# EAGLE design servo&air (EAGLE 7.2.0)
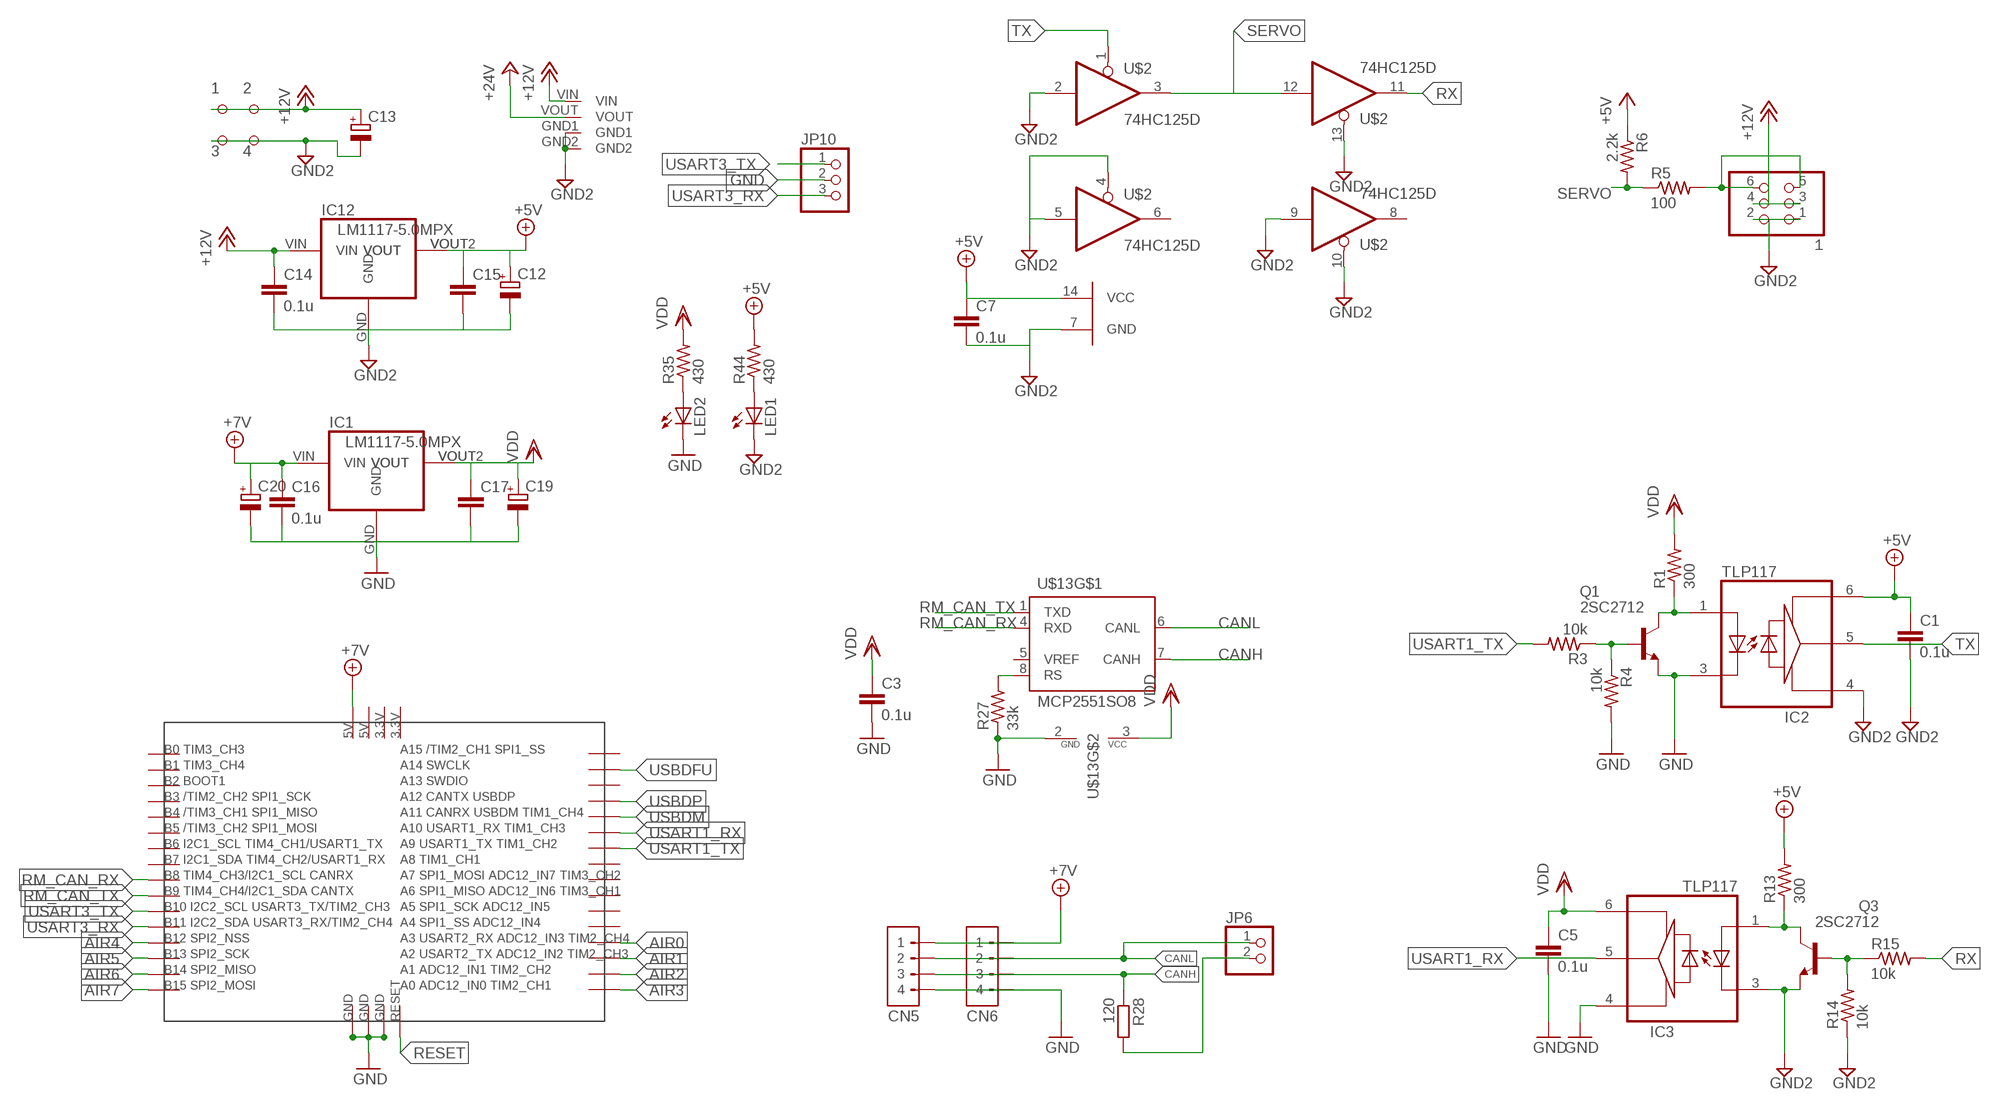
[diagram p0: schematic, sheet 1, part 1 of 2]
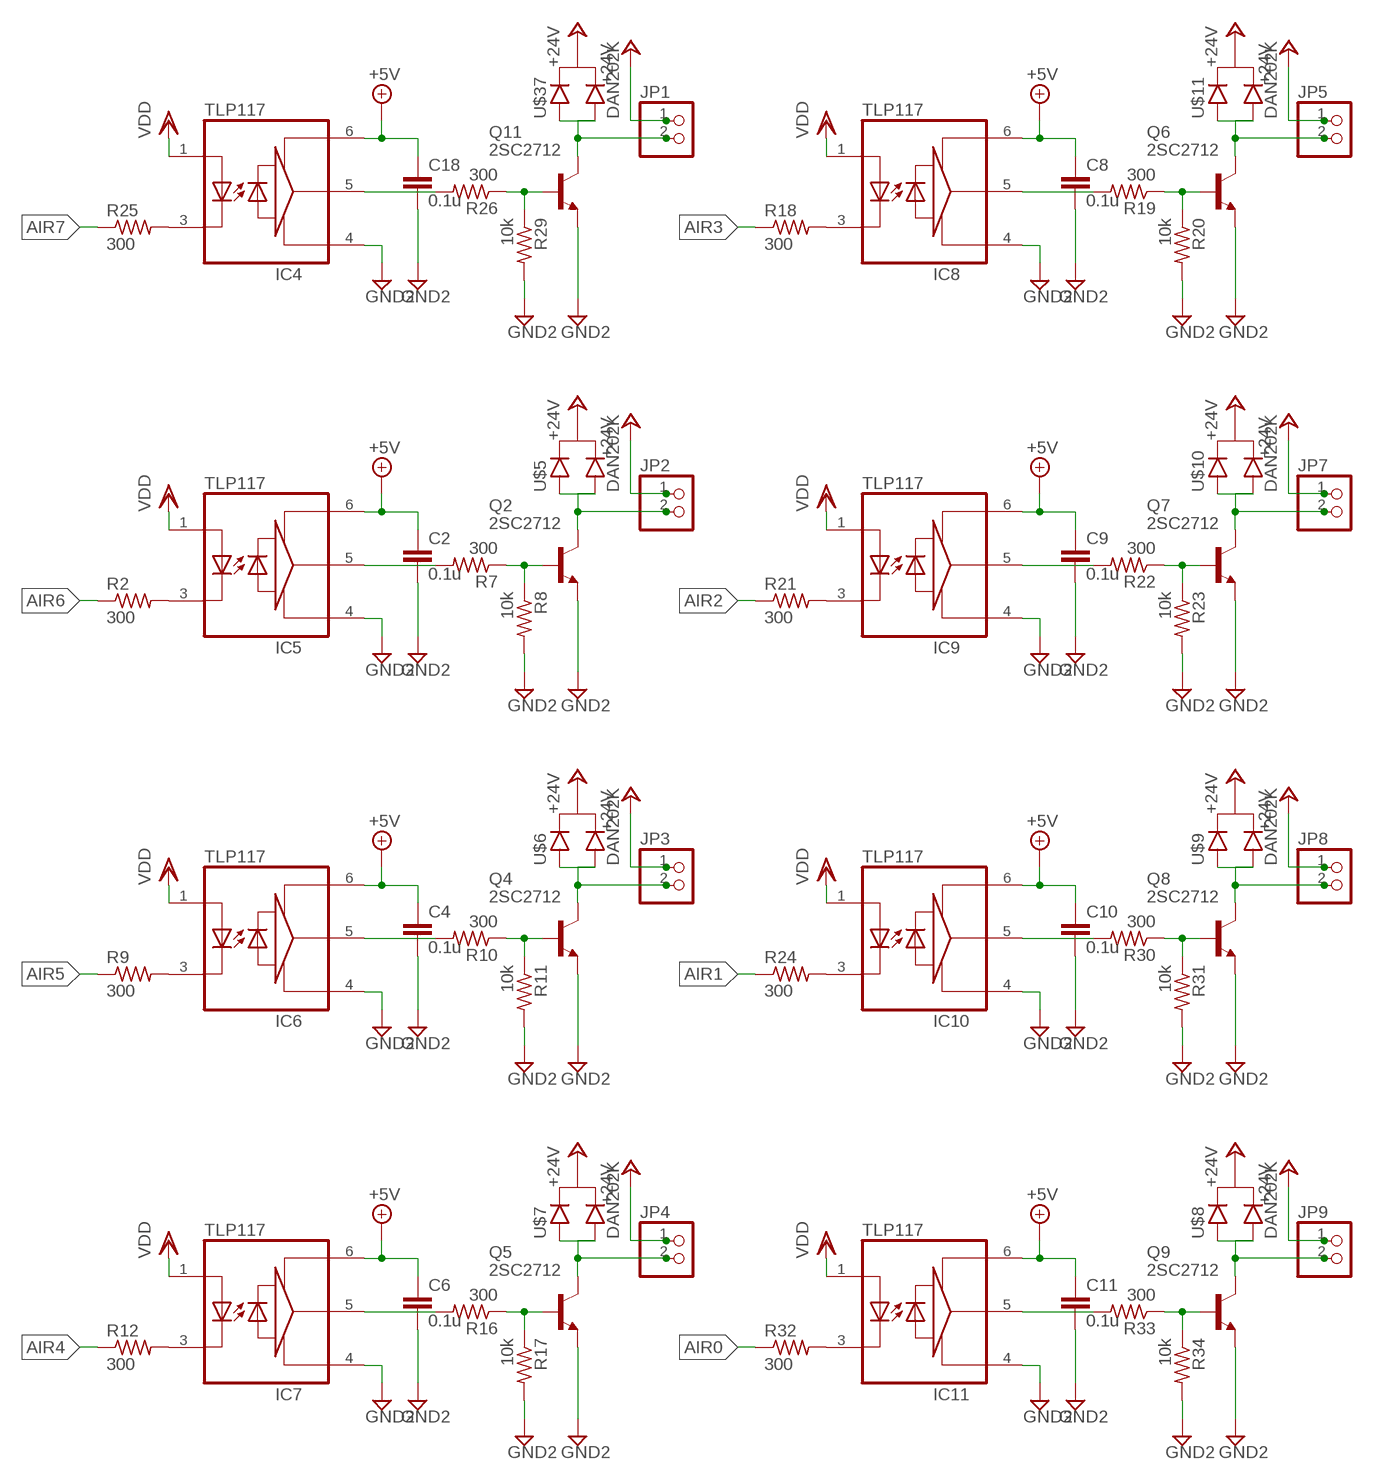
[diagram p1: schematic, sheet 1, part 2 of 2]

## Parts
C1  0.1u  C-EUC0603  [C0603]
C2  0.1u  C-EUC2012  [C2012]
C3  0.1u  C-EUC0603  [C0603]
C4  0.1u  C-EUC2012  [C2012]
C5  0.1u  C-EUC0603  [C0603]
C6  0.1u  C-EUC2012  [C2012]
C7  0.1u  C-EUC0603  [C0603]
C8  0.1u  C-EUC2012  [C2012]
C9  0.1u  C-EUC2012  [C2012]
C10  0.1u  C-EUC2012  [C2012]
C11  0.1u  C-EUC2012  [C2012]
C12  CPOL-EUE2.5-6  [E2,5-6]
C13  CPOL-EUE2.5-6  [E2,5-6]
C14  0.1u  C-EUC0603K  [C0603K]
C15  C-EUC0603K  [C0603K]
C16  0.1u  C-EUC0603K  [C0603K]
C17  C-EUC0603K  [C0603K]
C18  0.1u  C-EUC2012  [C2012]
C19  CPOL-EUE2.5-6  [E2,5-6]
C20  CPOL-EUE2.5-6  [E2,5-6]
CN5  CN4-JST-XH-TOP  [JST-B4B-XH-A]
CN6  CN4-JST-XH-TOP  [JST-B4B-XH-A]
IC1  LM1117-5.0MPX  LM1117-5.0IMP  [SOT223]
IC2  TLP117  [MFSOP6]
IC3  TLP117  [MFSOP6]
IC4  TLP117  [MFSOP6]
IC5  TLP117  [MFSOP6]
IC6  TLP117  [MFSOP6]
IC7  TLP117  [MFSOP6]
IC8  TLP117  [MFSOP6]
IC9  TLP117  [MFSOP6]
IC10  TLP117  [MFSOP6]
IC11  TLP117  [MFSOP6]
IC12  LM1117-5.0MPX  LM1117-5.0IMP  [SOT223]
JP1  PINHD-1X2/90  [1X02/90]
JP2  PINHD-1X2/90  [1X02/90]
JP3  PINHD-1X2/90  [1X02/90]
JP4  PINHD-1X2/90  [1X02/90]
JP5  PINHD-1X2/90  [1X02/90]
JP6  PINHD-1X2  [1X02]
JP7  PINHD-1X2/90  [1X02/90]
JP8  PINHD-1X2/90  [1X02/90]
JP9  PINHD-1X2/90  [1X02/90]
JP10  PINHD-1X3  [1X03]
LED1  LEDCHIPLED_1206  [CHIPLED_1206]
LED2  LEDCHIPLED_1206  [CHIPLED_1206]
Q1  2SC2712  [SC-59(TYPE1)]
Q2  2SC2712  [SC-59(TYPE1)]
Q3  2SC2712  [SC-59(TYPE1)]
Q4  2SC2712  [SC-59(TYPE1)]
Q5  2SC2712  [SC-59(TYPE1)]
Q6  2SC2712  [SC-59(TYPE1)]
Q7  2SC2712  [SC-59(TYPE1)]
Q8  2SC2712  [SC-59(TYPE1)]
Q9  2SC2712  [SC-59(TYPE1)]
Q11  2SC2712  [SC-59(TYPE1)]
R1  300  R-US_R0603  [R0603]
R2  300  R-US_R2012  [R2012]
R3  10k  R-US_R0603  [R0603]
R4  10k  R-US_R0603  [R0603]
R5  100  R-US_R0603  [R0603]
R6  2.2k  R-US_R0603  [R0603]
R7  300  R-US_R2012  [R2012]
R8  10k  R-US_R2012  [R2012]
R9  300  R-US_R2012  [R2012]
R10  300  R-US_R2012  [R2012]
R11  10k  R-US_R2012  [R2012]
R12  300  R-US_R2012  [R2012]
R13  300  R-US_R0603  [R0603]
R14  10k  R-US_R0603  [R0603]
R15  10k  R-US_R0603  [R0603]
R16  300  R-US_R2012  [R2012]
R17  10k  R-US_R2012  [R2012]
R18  300  R-US_R2012  [R2012]
R19  300  R-US_R2012  [R2012]
R20  10k  R-US_R2012  [R2012]
R21  300  R-US_R2012  [R2012]
R22  300  R-US_R2012  [R2012]
R23  10k  R-US_R2012  [R2012]
R24  300  R-US_R2012  [R2012]
R25  300  R-US_R2012  [R2012]
R26  300  R-US_R2012  [R2012]
R27  33k  R-US_R0603  [R0603]
R28  120  R-EU_R0603  [R0603]
R29  10k  R-US_R2012  [R2012]
R30  300  R-US_R2012  [R2012]
R31  10k  R-US_R2012  [R2012]
R32  300  R-US_R2012  [R2012]
R33  300  R-US_R2012  [R2012]
R34  10k  R-US_R2012  [R2012]
R35  430  R-US_M2012  [M2012]
R44  430  R-US_M2012  [M2012]
U$1  STBE_MINI  [STBEE_MINI]
U$2  74HC125D  [SO14]
U$3  5569  [5569]
U$4  LT3580  [LT3580]
U$5  DAN202K  [SC-59]
U$6  DAN202K  [SC-59]
U$7  DAN202K  [SC-59]
U$8  DAN202K  [SC-59]
U$9  DAN202K  [SC-59]
U$10  DAN202K  [SC-59]
U$11  DAN202K  [SC-59]
U$13  MCP2551SO8  [SO08]
U$37  DAN202K  [SC-59]
　　1  PINHD-2X3/90  [2X03/90]

## Nets
+5V [VCC]: C1.1 C2.1 C4.1 C6.1 C7.1 C8.1 C9.1 C10.1 C11.1 C12.+ C15.1 C18.1 IC2.6(VCC) IC4.6(VCC) IC5.6(VCC) IC6.6(VCC) IC7.6(VCC) IC8.6(VCC) IC9.6(VCC) IC10.6(VCC) IC11.6(VCC) IC12.VOUT IC12.VOUT2(VOUT) R6.1 R13.2 R44.2 U$2.14(VCC)
+7V [VCC]: C16.1 C20.+ CN5.1 CN6.1 IC1.VIN U$1.5V1
+12V: C13.+ C14.1 IC12.VIN U$3.1 U$3.2 U$4.VIN 　　1.3 　　1.4
+24V: JP1.1 JP2.1 JP3.1 JP4.1 JP5.1 JP7.1 JP8.1 JP9.1 U$4.VOUT U$5.K U$6.K U$7.K U$8.K U$9.K U$10.K U$11.K U$37.K
AIR0: R32.1 U$1.A3
AIR1: R24.1 U$1.A2
AIR2: R21.1 U$1.A1
AIR3: R18.1 U$1.A0
AIR4: R12.1 U$1.B12
AIR5: R9.1 U$1.B13
AIR6: R2.1 U$1.B14
AIR7: R25.1 U$1.B15
CANH: CN5.3 CN6.3 R28.1 U$13.7(CANH)
CANL: CN5.2 CN6.2 JP6.1 U$13.6(CANL)
GND [GND]: C3.2 C5.2 C16.2 C17.2 C19.- C20.- CN5.4 CN6.4 IC1.GND IC2.3 IC3.4(GND) JP10.2 LED2.C Q1.E R4.2 R27.1 U$1.GND1 U$1.GND2 U$1.GND3 U$13.2(GND)
GND2: C1.2 C2.2 C4.2 C6.2 C7.2 C8.2 C9.2 C10.2 C11.2 C12.- C13.- C14.2 C15.2 C18.2 IC2.4(GND) IC3.3 IC4.4(GND) IC5.4(GND) IC6.4(GND) IC7.4(GND) IC8.4(GND) IC9.4(GND) IC10.4(GND) IC11.4(GND) IC12.GND LED1.C Q2.E Q3.E Q4.E Q5.E Q6.E Q7.E Q8.E Q9.E Q11.E R8.2 R11.2 R14.1 R17.2 R20.2 R23.2 R29.2 R31.2 R34.2 U$2.2(1A) U$2.4(2OE) U$2.5(2A) U$2.7(GND) U$2.9(3A) U$2.10(3OE) U$2.13(4OE) U$3.3 U$3.4 U$4.GND1 U$4.GND2 　　1.1 　　1.2
N$1: IC4.3 R25.2
N$2: IC5.5 R7.2
N$3: IC5.3 R2.2
N$4: IC6.3 R9.2
N$5: JP1.2 Q11.C U$37.A@1(A1) U$37.A@2(A2)
N$7: R5.2 　　1.5 　　1.6
N$8: Q2.B R7.1 R8.1
N$9: JP2.2 Q2.C U$5.A@1(A1) U$5.A@2(A2)
N$10: IC7.3 R12.2
N$11: IC6.5 R10.2
N$12: Q4.B R10.1 R11.1
N$13: JP3.2 Q4.C U$6.A@1(A1) U$6.A@2(A2)
N$14: IC2.1 Q1.C R1.1
N$15: IC8.3 R18.2
N$16: IC3.1 Q3.C R13.1
N$17: Q1.B R3.1 R4.1
N$18: IC4.5 R26.2
N$19: Q11.B R26.1 R29.1
N$20: IC9.3 R21.2
N$21: IC7.5 R16.2
N$22: Q3.B R14.2 R15.1
N$23: Q5.B R16.1 R17.1
N$24: JP4.2 Q5.C U$7.A@1(A1) U$7.A@2(A2)
N$25: IC10.3 R24.2
N$26: IC8.5 R19.2
N$27: Q6.B R19.1 R20.1
N$28: JP5.2 Q6.C U$11.A@1(A1) U$11.A@2(A2)
N$29: IC11.3 R32.2
N$30: IC9.5 R22.2
N$31: R27.2 U$13.8(RS)
N$32: JP6.2 R28.2
N$33: Q7.B R22.1 R23.1
N$34: JP7.2 Q7.C U$10.A@1(A1) U$10.A@2(A2)
N$35: LED1.A R44.1
N$36: IC10.5 R30.2
N$37: Q8.B R30.1 R31.1
N$38: JP8.2 Q8.C U$9.A@1(A1) U$9.A@2(A2)
N$39: LED2.A R35.1
N$40: IC11.5 R33.2
N$41: Q9.B R33.1 R34.1
N$42: JP9.2 Q9.C U$8.A@1(A1) U$8.A@2(A2)
RESET: U$1.RESET
RM_CAN_RX: U$1.B8 U$13.4(RXD)
RM_CAN_TX: U$1.B9 U$13.1(TXD)
RX: R15.2 U$2.11(4Y)
SERVO: R5.1 R6.2 U$2.3(1Y) U$2.12(4A)
TX: IC2.5 U$2.1(1OE)
USART1_RX: IC3.5 U$1.A10
USART1_TX: R3.2 U$1.A9
USART3_RX: JP10.3 U$1.B11
USART3_TX: JP10.1 U$1.B10
USBDFU: U$1.A14
USBDM: U$1.A11
USBDP: U$1.A12
VDD [VCC]: C3.1 C5.1 C17.1 C19.+ IC1.VOUT IC1.VOUT2(VOUT) IC3.6(VCC) IC4.1 IC5.1 IC6.1 IC7.1 IC8.1 IC9.1 IC10.1 IC11.1 R1.2 R35.2 U$13.3(VCC)
Unconnected: U$1.3.3V1 U$1.3.3V2 U$1.5V2 U$1.A4 U$1.A5 U$1.A6 U$1.A7 U$1.A8 U$1.A13 U$1.A15 U$1.B0 U$1.B1 U$1.B2 U$1.B3 U$1.B4 U$1.B5 U$1.B6 U$1.B7 U$2.6(2Y) U$2.8(3Y) U$13.5(VREF)

## Library data of the parts
C1-C11 C18 = rcl:C-EU: CAPACITOR, European symbol
C12 C13 C19 C20 = rcl:CPOL-EU: POLARIZED CAPACITOR, European symbol
C14-C17 = resistor:C-EU: CAPACITOR, European symbol
CN5 CN6 = con-jst_xh:CN4: Connector 4 circuits
IC1 IC12 = Regulator:LM1117: 800mA and 1A Low Dropout (LDO) Positive Regulator 1.8V, 2.5V, 2.85V, 3.3V, 5V, and Adj
IC2-IC11 = PhotoCoupler:TLP117
JP1-JP9 = pinhead:PINHD-1X2: PIN HEADER
JP10 = pinhead:PINHD-1X3: PIN HEADER
LED1 LED2 = led:LED: LED OSRAM: - CHIPLED LG R971, LG N971, LY N971, LG Q971, LY Q971, LO R971, LY R971 LH N974, LH R974 LS Q976, LO Q976, LY Q976 LO Q996 - Hyper CHIPLED LW Q18S LB Q993, LB Q99A, LB R99A - SideLED LS A670, LO A670, LY A670, LG A670, LP A670 LB A673, LV A673, LT A673, LW A673 LH A674 LY A675 LS A676, LA A676, LO A676, LY A676, LW A676 LS A679, LY A679, LG A679 - Hyper Micro SIDELED® LS Y876, LA Y876, LO Y876, LY Y876 LT Y87S - SmartLED LW L88C, LW L88S LB L89C, LB L89S, LG L890 LS L89K, LO L89K, LY L89K LS L896, LA L896, LO L896, LY L896 - TOPLED LS T670, LO T670, LY T670, LG T670, LP T670 LSG T670, LSP T670, LSY T670, LOP T670, LYG T670 LG T671, LOG T671, LSG T671 LB T673, LV T673, LT T673, LW T673 LH T674 LS T676, LA T676, LO T676, LY T676, LB T676, LH T676, LSB T676, LW T676 LB T67C, LV T67C, LT T67C, LS T67K, LO T67K, LY T67K, LW E67C LS E67B, LA E67B, LO E67B, LY E67B, LB E67C, LV E67C, LT E67C LW T67C LS T679, LY T679, LG T679 LS T770, LO T770, LY T770, LG T770, LP T770 LB T773, LV T773, LT T773, LW T773 LH T774 LS E675, LA E675, LY E675, LS T675 LS T776, LA T776, LO T776, LY T776, LB T776 LHGB T686 LT T68C, LB T68C - Hyper Mini TOPLED® LB M676 - Mini TOPLED Santana® LG M470 LS M47K, LO M47K, LY M47K Source: http://www.osram.convergy.de LUXEON: - LUMILED® LXK2-PW12-R00, LXK2-PW12-S00, LXK2-PW14-U00, LXK2-PW14-V00 LXK2-PM12-R00, LXK2-PM12-S00, LXK2-PM14-U00 LXK2-PE12-Q00, LXK2-PE12-R00, LXK2-PE12-S00, LXK2-PE14-T00, LXK2-PE14-U00 LXK2-PB12-K00, LXK2-PB12-L00, LXK2-PB12-M00, LXK2-PB14-N00, LXK2-PB14-P00, LXK2-PB14-Q00 LXK2-PR12-L00, LXK2-PR12-M00, LXK2-PR14-Q00, LXK2-PR14-R00 LXK2-PD12-Q00, LXK2-PD12-R00, LXK2-PD12-S00 LXK2-PH12-R00, LXK2-PH12-S00 LXK2-PL12-P00, LXK2-PL12-Q00, LXK2-PL12-R00 Source: www.luxeon.com KINGBRIGHT: KA-3528ASYC Source: www.kingbright.com
Q1-Q9 Q11 = Transistor:2SC2712
R1-R26 R29-R35 R44 = rcl:R-US_: RESISTOR, American symbol
R27 = resistor:R-US_: RESISTOR, American symbol
R28 = resistor:R-EU_: RESISTOR, European symbol
U$1 = stbee_mini:STBE_MINI
U$2 = 74HC125D:74HC125D
U$3 = 5569:5569
U$4 = lt3580:LT3580
U$5-U$11 U$37 = DAN202K:DAN202K
U$13 = can:MCP2551: CAN Tranceiver Microchip
　　1 = pinhead:PINHD-2X3: PIN HEADER

## Board
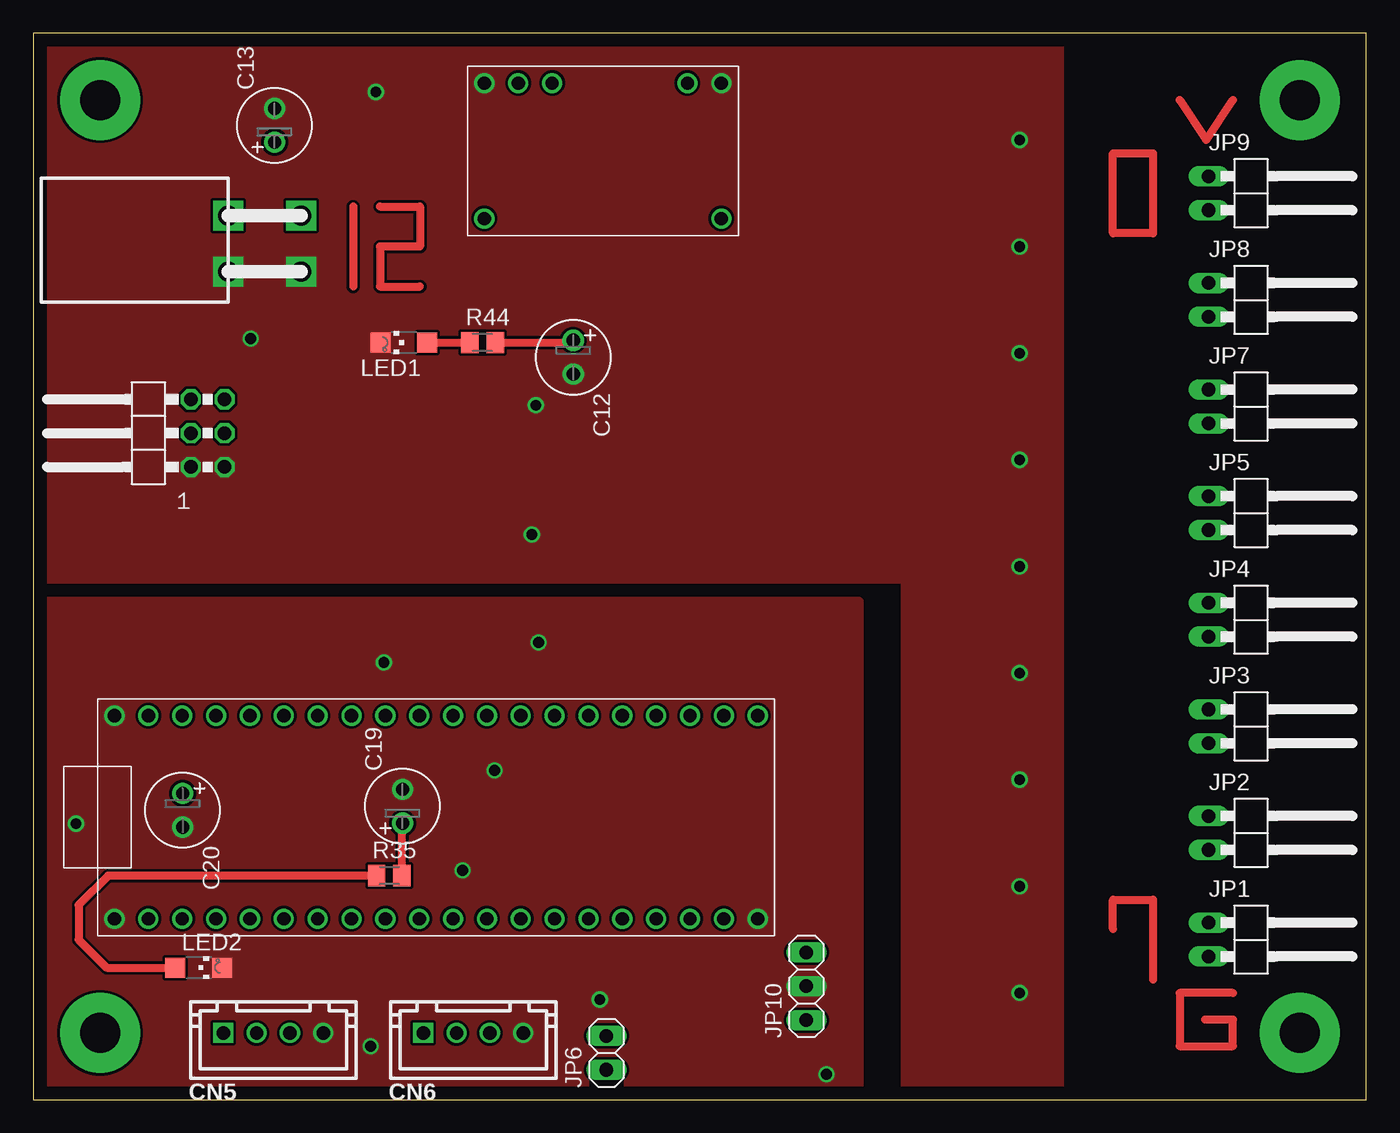
[diagram p2: board, top side]
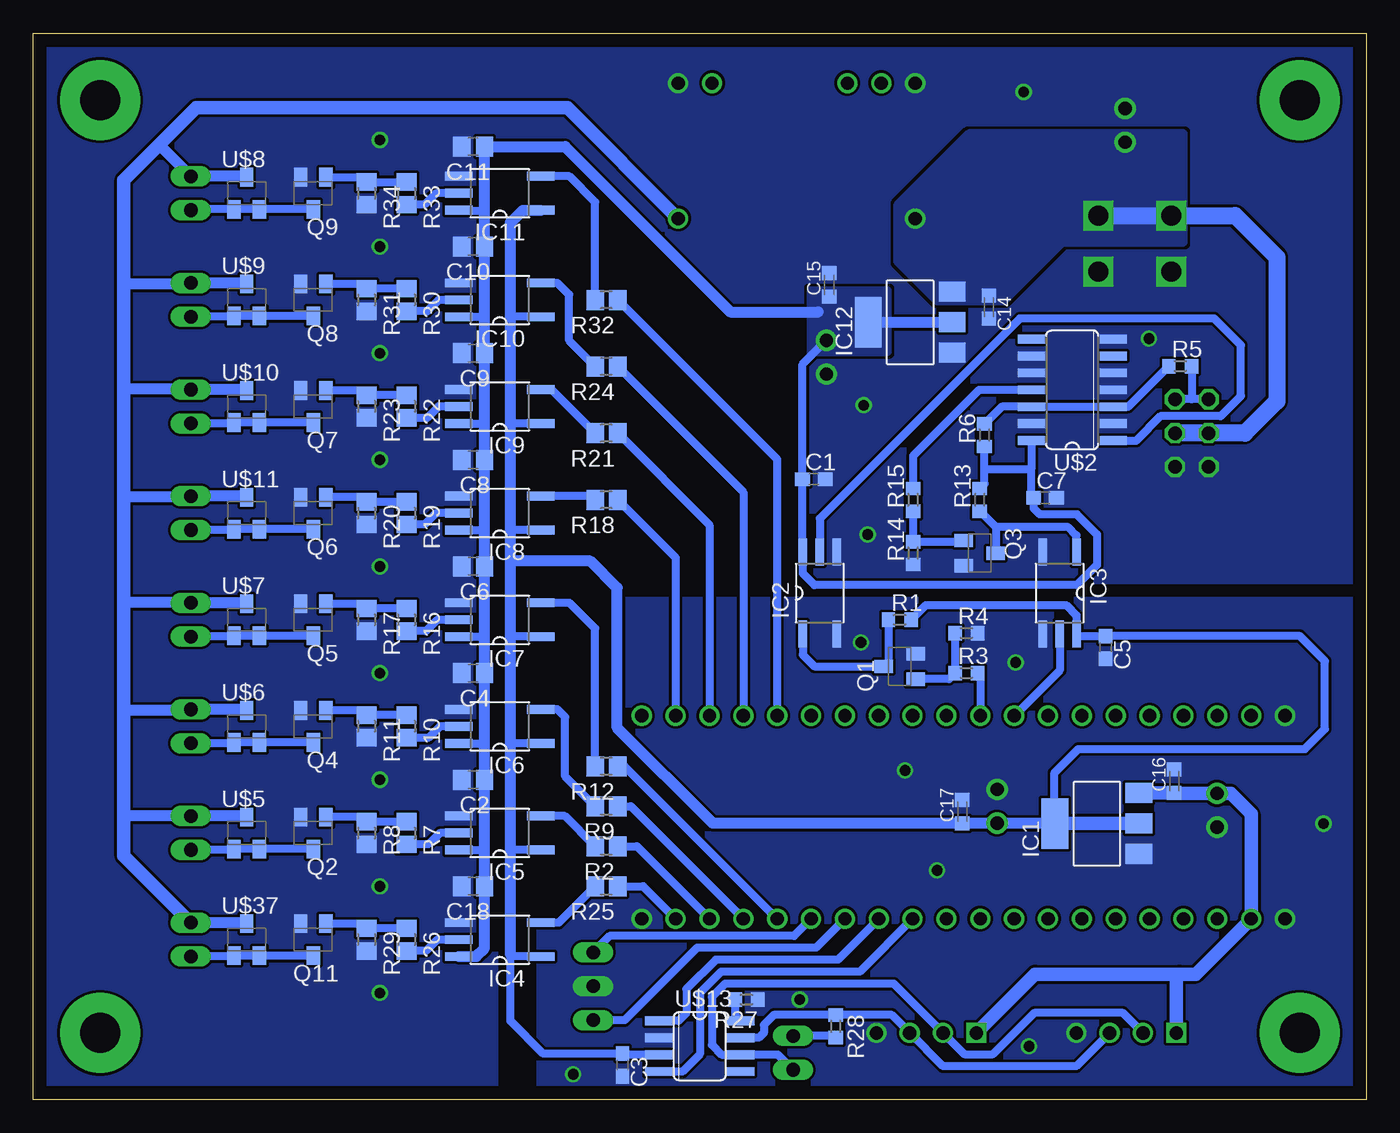
[diagram p3: board, bottom side, seen from below]

Size 100 x 80 mm. Coordinates in mm from the lower left corner, seen from the top.
Outline: 0,0 100,0 100,80 0,80 0,0
Copper layers (1*16): Top 0.035mm / dielectric 1.5mm / Bottom 0.035mm
Design rules "default *": minimum track width 14mil, minimum drill 24mil, track to track 8mil, track to pad 8mil, pad to pad 8mil, via to via 8mil, smd to smd 8mil, copper to edge 40mil, drill to drill 8mil, minimum pad ring 10mil, minimum via ring 8mil, stop-mask expansion 4mil, vias tented up to drill 0mil, thermal gap 10mil

### Footprints (pad centres in the part's own frame; a part is rotated, then mirrored left to right if it is on the bottom)
C0603 = smd 1.1 x 1: 1 -0.85,0; 2 0.85,0
C2012 = smd 1.3 x 1.5: 1 -0.85,0; 2 0.85,0
E2,5-6 = drill 1 pad 1.6: + -1.27,0; - 1.27,0
C0603K = smd 1.05 x 1.08: 1 -0.875,0; 2 0.875,0
JST-B4B-XH-A = drill 1 square: 1 -3.75,0 | drill 1: 2 -1.25,0; 3 1.25,0; 4 3.75,0
SOT223 = smd 1.499 x 2.007: GND -2.261,-3.15; VIN 2.311,-3.15; VOUT 0.025,-3.15 | smd 3.81 x 2.007: VOUT2 0,3.15
MFSOP6 = smd 0.66 x 2.032: 1 -1.27,-3.073; 3 1.27,-3.073; 4 1.27,3.073; 5 0,3.073; 6 -1.27,3.073
1X02/90 = drill 1.016 long: 1 -1.27,-3.81; 2 1.27,-3.81
1X02 = drill 1.016 long: 1 -1.27,0; 2 1.27,0
1X03 = drill 1.016 long: 1 -2.54,0; 2 0,0; 3 2.54,0
CHIPLED_1206 = smd 1.5 x 1.5: A 0,-1.75; C 0,1.75
SC-59(TYPE1) = smd 1 x 1.4: B -0.95,-1.2; C 0,1.2; E 0.95,-1.2
R0603 = smd 1 x 1.1: 1 -0.85,0; 2 0.85,0
R2012 = smd 1.3 x 1.5: 1 -0.85,0; 2 0.85,0
M2012 = smd 1.3 x 1.6: 1 -0.95,0; 2 0.95,0
STBEE_MINI = drill 1: 3.3V1 -7.62,19.05; 3.3V2 7.62,19.05; 5V1 -7.62,21.59; 5V2 7.62,21.59; A0 7.62,-21.59; A1 7.62,-19.05; A2 7.62,-16.51; A3 7.62,-13.97; A4 7.62,-11.43; A5 7.62,-8.89; A6 7.62,-6.35; A7 7.62,-3.81; A8 7.62,-1.27; A9 7.62,1.27; A10 7.62,3.81; A11 7.62,6.35; A12 7.62,8.89; A13 7.62,11.43; A14 7.62,13.97; A15 7.62,16.51; B0 -7.62,16.51; B1 -7.62,13.97; B2 -7.62,11.43; B3 -7.62,8.89; B4 -7.62,6.35; B5 -7.62,3.81; B6 -7.62,1.27; B7 -7.62,-1.27; B8 -7.62,-3.81; B9 -7.62,-6.35; B10 -7.62,-8.89; B11 -7.62,-11.43; B12 -7.62,-13.97; B13 -7.62,-16.51; B14 -7.62,-19.05; B15 -7.62,-21.59; GND1 -7.62,24.13; GND2 -7.62,-24.13; GND3 7.62,24.13; RESET 7.62,-24.13
SO14 = smd 2.032 x 0.66: 1 -3.073,3.81; 2 -3.073,2.54; 3 -3.073,1.27; 4 -3.073,0; 5 -3.073,-1.27; 6 -3.073,-2.54; 7 -3.073,-3.81; 8 3.073,-3.81; 9 3.073,-2.54; 10 3.073,-1.27; 11 3.073,0; 12 3.073,1.27; 13 3.073,2.54; 14 3.073,3.81
5569 = drill 1.5 square: 1 0,2.1; 2 5.5,2.1; 3 0,-2.1; 4 5.5,-2.1
LT3580 = drill 1: GND1 1.27,11.43; GND2 19.05,11.43; P$2 3.81,11.43; P$4 6.35,11.43; P$5 16.51,11.43; VIN 1.27,1.27; VOUT 19.05,1.27
SC-59 = smd 1 x 1.4: A@1 -0.95,-1.2; A@2 0.95,-1.2; K 0,1.2
SO08 = smd 0.66 x 2.032: 1 -1.905,-3.073; 2 -0.635,-3.073; 3 0.635,-3.073; 4 1.905,-3.073; 5 1.905,3.073; 6 0.635,3.073; 7 -0.635,3.073; 8 -1.905,3.073
2X03/90 = drill 1.016 octagon: 1 -2.54,-6.35; 2 -2.54,-3.81; 3 0,-6.35; 4 0,-3.81; 5 2.54,-6.35; 6 2.54,-3.81

### Placement (x,y rotation side)
C1  41.44,46.55 0 bottom
C2  67,24 180 bottom
C3  55.8,2.6 270 bottom
C4  67,32 180 bottom
C5  19.55,33.92 270 bottom
C6  67,40 180 bottom
C7  24.1,45.15 0 bottom
C8  67,48 180 bottom
C9  67,56 180 bottom
C10  67,64 180 bottom
C11  67,71.5 180 bottom
C12  40.5,55.7 270 top
C13  18.1,73.1 90 top
C14  28.31,59.46 270 bottom
C15  40.29,61.12 90 bottom
C16  14.4,23.9 90 bottom
C17  30.3,21.6 90 bottom
C18  67,16 180 bottom
C19  27.7,22 90 top
C20  11.2,21.7 270 top
CN5  18,5 0 top
CN6  33,5 0 top
IC1  20.2,20.7 90 bottom
IC2  41,38 0 bottom
IC3  23,38 180 bottom
IC4  65,12 90 bottom
IC5  65,20 90 bottom
IC6  65,28 90 bottom
IC7  65,36 90 bottom
IC8  65,44 90 bottom
IC9  65,52 90 bottom
IC10  65,60 90 bottom
IC11  65,68 90 bottom
IC12  34.21,58.31 90 bottom
JP1  92,12 270 top
JP2  92,20 270 top
JP3  92,28 270 top
JP4  92,36 270 top
JP5  92,44 270 top
JP6  43,3.5 90 top
JP7  92,52 270 top
JP8  92,60 270 top
JP9  92,68 270 top
JP10  58,8.5 90 top
LED1  27.8,56.8 90 top
LED2  12.4,9.9 270 top
Q1  35,32.5 90 bottom
Q2  79,20 180 bottom
Q3  29,41 270 bottom
Q4  79,28 180 bottom
Q5  79,36 180 bottom
Q6  79,44 180 bottom
Q7  79,52 180 bottom
Q8  79,60 180 bottom
Q9  79,68 180 bottom
Q11  79,12 180 bottom
R1  35,36 0 bottom
R2  57,19 180 bottom
R3  30,32 0 bottom
R4  30,35 0 bottom
R5  13.96,55.02 0 bottom
R6  28.64,49.84 90 bottom
R7  72,20 270 bottom
R8  75,20 270 bottom
R9  57,22 180 bottom
R10  72,28 270 bottom
R11  75,28 270 bottom
R12  57,25 180 bottom
R13  29,45 90 bottom
R14  34,41 90 bottom
R15  34,45 90 bottom
R16  72,36 270 bottom
R17  75,36 270 bottom
R18  57,45 180 bottom
R19  72,44 270 bottom
R20  75,44 270 bottom
R21  57,50 180 bottom
R22  72,52 270 bottom
R23  75,52 270 bottom
R24  57,55 180 bottom
R25  57,16 180 bottom
R26  72,12 270 bottom
R27  46.5,7.5 180 bottom
R28  39.8,5.5 270 bottom
R29  75,12 270 bottom
R30  72,60 270 bottom
R31  75,60 270 bottom
R32  57,60 180 bottom
R33  72,68 270 bottom
R34  75,68 270 bottom
R35  26.7,16.8 0 top
R44  33.7,56.8 0 top
U$1  30.22,21.18 90 top
U$2  22.05,53.25 180 bottom
U$3  14.61,64.23 0 top
U$4  32.57,64.83 0 top
U$5  84,20 0 bottom
U$6  84,28 0 bottom
U$7  84,36 0 bottom
U$8  84,68 0 bottom
U$9  84,60 0 bottom
U$10  84,52 0 bottom
U$11  84,44 0 bottom
U$13  50,4 270 bottom
U$37  84,12 0 bottom
　　1  8,50 90 top

### Tracks (layer width: path | path; a pad name or v marks a point on that pad's centre or on a via)
+5V
  Top 0.61: R44.2 40.33,56.8 C12.+
  Bottom 0.61: U$2.14 25.12,47.32 | 25.12,47.32 28.62,47.32 28.64,47.3 | C12.+ 42.29,55.18 C1.1 42.29,41.09 IC2.6 42.27,39.47 41.4,38.6 21.7,38.6 20.2,40.1 20.2,42.4 21.7,43.9 24.5,43.9 24.95,44.35 C7.1 25.12,45.32 25.12,47.32 | R13.2 28.64,46.21 28.64,47.3 | 28.64,47.3 R6.1 | IC11.6 68.04,66.7 66.15,66.7 | IC10.6 66.22,58.73 66.15,58.8 | IC9.6 66.18,50.73 66.15,50.7 | IC8.6 66.18,42.73 66.15,42.7 | IC7.6 66.18,34.73 66.15,34.7 | IC6.6 66.38,26.73 66.15,26.5 | IC5.6 66.18,18.73 66.15,18.7
  Bottom 0.813: IC12.VOUT 31.09,58.31 IC12.VOUT2 | IC4.6 66.77,10.73 66.15,11.35 C18.1 66.15,18.7 C2.1 66.15,26.5 C4.1 66.15,34.7 C6.1 66.15,42.7 C8.1 66.15,50.7 C9.1 66.15,58.8 C10.1 66.15,66.7 C11.1 60.1,71.5 47.7,59.1 41.1,59.1
  pour Bottom (no thermals): 35.9,60.7 41.7,60.7 41.7,56.1 35.9,56.1
+7V
  Bottom 1.016: CN6.1 24.85,9.4 14,9.4 | 14,9.4 12.79,9.4 U$1.5V1 8.63,21.43 10.17,22.97 C20.+ 14.35,22.97 C16.1 17.04,23.02 IC1.VIN | CN5.1 14.25,9.15 14,9.4
+12V
  Bottom 1.27: U$3.2 U$3.1 9.83,66.33 6.7,63.2 6.7,52.4 9.1,50 　　1.4 　　1.3
  pour Bottom (no thermals): 13.7,72.5 29.8,72.5 35.2,67.1 35.2,62.9 32.2,59.9 27.2,59.9 22.8,64.3 13.7,64.3
+24V
  Bottom 0.813: U$8.K 84.07,69.27 JP9.1 90.42,71.5 90.7,71.5 | U$9.K 84.07,61.27 JP8.1 88.26,61.2 93.2,61.2 | U$10.K 84.07,53.27 JP7.1 88.22,53.3 93.2,53.3 | U$11.K 84.07,45.27 JP5.1 88.26,45.2 93.2,45.2 | U$7.K 84.07,37.27 JP4.1 88.22,37.3 93.2,37.3 | U$6.K 84.07,29.27 JP3.1 88.26,29.2 93.2,29.2 | U$5.K 84.07,21.27 JP2.1 88.22,21.3 93.2,21.3 | U$37.K 84.07,13.27 JP1.1
  Bottom 1.016: JP1.1 93.2,18.28 93.2,21.3 93.2,29.2 93.2,37.3 93.2,45.2 93.2,53.3 93.2,61.2 93.2,69 90.7,71.5 89.15,73.05 88.9,73.3 87.8,74.4 59.92,74.4 U$4.VOUT
AIR0
  Bottom 0.61: R32.1 44.19,48.04 U$1.A3
AIR1
  Bottom 0.61: R24.1 46.73,45.58 U$1.A2
AIR2
  Bottom 0.61: R21.1 49.27,43.12 U$1.A1
AIR3
  Bottom 0.61: R18.1 51.81,40.66 U$1.A0
AIR4
  Bottom 0.61: U$1.B12 55.63,25 R12.1
AIR5
  Bottom 0.61: R9.1 55.17,22 U$1.B13
AIR6
  Bottom 0.61: R2.1 54.71,19 U$1.B14
AIR7
  Bottom 0.61: R25.1 54.25,16 U$1.B15
CANH
  Bottom 0.61: CN5.3 21.75,2.5 31.75,2.5 CN6.3 35.6,6.35 R28.1 44.45,6.35 45.2,5.6 45.2,5 45.56,4.63 U$13.7
CANL
  Bottom 0.61: CN5.2 18.25,6.5 24.9,6.5 28,3.4 30.15,3.4 CN6.2 35.45,8.7 48.1,8.7 49.1,7.7 49.1,4.1 48.37,3.37 U$13.6 44.13,3.37 JP6.1
GND  (via drill 0.8)
  other vias: 25.3,4 26.3,32.8 37.9,34.3 3.2,20.7 32.2,17.2 34.6,24.7 42.5,7.5 59.5,1.9
  pour Bottom (rank 6, no thermals): -6.1,37.4 62,37.4 62,-6.6 -6.1,-6.6
  pour Top (no thermals): 62,37.4 -10.3,37.4 -10.3,-10.3 62,-10.3
GND2  (via drill 0.8)
  other vias: 74,72 74,64 74,56 74,48 74,40 74,32 74,24 74,16 74,8 16.3,57.1 37.4,42.4 37.7,52.1 25.7,75.6
  pour Bottom (rank 6, no thermals): -6,87.7 110.8,87.7 110.8,-8.8 65.4,-8.8 65.4,39 -6,39
  pour Top (rank 6, no thermals): -9.1,82.4 77,82.4 77,-3.4 65.4,-3.4 65.4,39 -9.1,39
N$1
  Bottom 0.61: R25.2 60.58,13.27 IC4.3
N$2
  Bottom 0.61: IC5.5 69.5,20 70.35,19.15 R7.2
N$3
  Bottom 0.61: R2.2 60.12,21.27 IC5.3
N$4
  Bottom 0.61: R9.2 60.1,24.25 60.1,28.7 60.67,29.27 IC6.3
N$5
  Bottom 0.61: Q11.C U$37.A@2 U$37.A@1 85.02,10.73 JP1.2
N$6  (via drill 3 pad 6)
  other vias: 5,5
N$7
  Bottom 0.61: 　　1.6 13.1,52.54 | 13.1,52.54 　　1.5 | R5.2 13.1,52.54
N$8
  Bottom 0.61: R7.1 R8.1 75.35,21.2 Q2.B
N$9
  Bottom 0.61: Q2.C U$5.A@2 U$5.A@1 85.02,18.73 JP2.2
N$10
  Bottom 0.61: R12.2 57.85,35.35 59.77,37.27 IC7.3
N$11
  Bottom 0.61: IC6.5 69.5,28 70.35,27.15 R10.2
N$12
  Bottom 0.61: R10.1 R11.1 75.35,29.2 Q4.B
N$13
  Bottom 0.61: Q4.C U$6.A@2 U$6.A@1 85.02,26.73 JP3.2
N$14
  Bottom 0.61: R1.1 35.85,32.85 Q1.C 41.4,32.5 42.27,33.37 IC2.1
N$15
  Bottom 0.61: R18.2 58.12,45.27 IC8.3
N$16
  Bottom 0.61: R13.1 27.8,42.95 | 27.8,42.95 Q3.C | 27.8,42.95 22.35,42.95 21.73,42.33 IC3.1
N$17
  Bottom 0.61: R4.1 R3.1 31.3,31.55 Q1.B
N$18
  Bottom 0.61: IC4.5 69.7,12 70.55,11.15 R26.2
N$19
  Bottom 0.61: R26.1 R29.1 75.35,13.2 Q11.B
N$20
  Bottom 0.61: R21.2 61.12,53.27 IC9.3
N$21
  Bottom 0.61: IC7.5 69.7,36 70.55,35.15 R16.2
N$22
  Bottom 0.61: Q3.B 30.3,41.85 R14.2 R15.1
N$23
  Bottom 0.61: R16.1 R17.1 75.35,37.2 Q5.B
N$24
  Bottom 0.61: Q5.C U$7.A@2 U$7.A@1 85.02,34.73 JP4.2
N$25
  Bottom 0.61: R24.2 59.8,56.95 59.8,60.4 60.67,61.27 IC10.3
N$26
  Bottom 0.61: IC8.5 69.8,44 70.65,43.15 R19.2
N$27
  Bottom 0.61: R19.1 R20.1 75.35,45.2 Q6.B
N$28
  Bottom 0.61: Q6.C U$11.A@2 U$11.A@1 85.02,42.73 JP5.2
N$29
  Bottom 0.61: R32.2 57.85,67.35 59.77,69.27 IC11.3
N$30
  Bottom 0.61: IC9.5 69.6,52 70.45,51.15 R22.2
N$31
  Bottom 0.61: R27.2 47.35,6.33 U$13.8
N$32
  Bottom 0.61: R28.2 39.92,4.77 JP6.2
N$33
  Bottom 0.61: R22.1 R23.1 75.35,53.2 Q7.B
N$34
  Bottom 0.61: Q7.C U$10.A@2 U$10.A@1 85.02,50.73 JP7.2
N$35
  Top 0.61: LED1.A R44.1
N$36
  Bottom 0.61: IC10.5 69.6,60 70.45,59.15 R30.2
N$37
  Bottom 0.61: R30.1 R31.1 75.35,61.2 Q8.B
N$38
  Bottom 0.61: Q8.C U$9.A@2 U$9.A@1 85.02,58.73 JP8.2
N$39
  Top 0.61: R35.1 5.6,16.8 3.4,14.6 3.4,12 5.5,9.9 LED2.A
N$40
  Bottom 0.61: IC11.5 69.8,68 70.65,67.15 R33.2
N$41
  Bottom 0.61: Q9.B 75.35,69.2 R34.1 R33.1
N$42
  Bottom 0.61: Q9.C U$8.A@2 U$8.A@1 88.12,66.8 JP9.2
N$43  (via drill 3 pad 6)
  other vias: 95,5
N$44  (via drill 3 pad 6)
  other vias: 95,75
N$45  (via drill 3 pad 6)
  other vias: 5,75
N$46
  Top 0.61: 81,71 84,71 84,65 81,65 81,71
N$47
  Top 0.61: 81,12.8 81,15 84,15 84,9
N$48
  Top 0.61: 86,75 88,72 90,75
N$49
  Top 0.61: 90,8 86,8 86,4 90,4 90,6 87.9,6
N$50
  Top 0.61: 24,67 24,61
N$51
  Top 0.61: 26,67 29,67 29,64 26,64 26,61 29,61
RM_CAN_RX
  Bottom 0.61: U$13.4 51.3,2.1 50,3.4 50,8 48.4,9.6 37.99,9.6 U$1.B8
RM_CAN_TX
  Bottom 0.61: U$1.B9 39.63,10.5 48.8,10.5 51,8.3 51,6.5 51.59,5.91 U$13.1
RX
  Bottom 0.61: U$2.11 29.05,53.25 34,48.3 R15.2
SERVO
  Bottom 0.61: R5.1 17.85,51.98 U$2.3 U$2.12 27.35,51.98 R6.2
TX
  Bottom 0.61: U$2.1 17.26,49.44 15.43,51.27 10.92,51.27 9.4,52.79 9.4,56.6 11.4,58.6 26,58.6 41,43.6 IC2.5
USART1_RX
  Bottom 0.61: IC3.5 23,32.21 U$1.A10
USART1_TX
  Bottom 0.61: R3.2 28.95,31.8 U$1.A9
USART3_RX
  Bottom 0.61: U$1.B11 42.93,12.28 56.76,12.28 JP10.3
USART3_TX
  Bottom 0.61: U$1.B10 41.27,11.4 50.2,11.4 55.64,5.96 JP10.1
VDD
  Top 0.61: R35.2 27.65,20.68 C19.+
  Bottom 0.61: IC10.1 64.17,58.73 64.2,58.7 | IC9.1 64.17,50.73 64.2,50.7 | IC8.1 64.07,42.73 64.2,42.6 | IC7.1 64.17,34.73 64.2,34.7 | IC6.1 64.17,26.73 64.2,26.7 | IC5.1 64.07,18.73 64.2,18.6 | IC4.1 64.03,10.73 64.2,10.9 | R1.2 33.05,37.1 22.5,37.1 21.73,36.33 IC3.6 21.57,34.77 C5.1 4.97,34.77 3.1,32.9 3.1,27.8 4.6,26.3 21.6,26.3 23.38,24.52 23.38,20.73 | U$13.3 55.72,3.37 C3.1 61.75,3.45 64.2,5.9 64.2,11.1
  Bottom 0.813: 64.2,10.9 64.2,11.1 64.2,18.6 64.2,26.7 64.2,34.7 64.2,40.3 | 64.2,40.3 64.2,42.6 64.2,50.7 64.2,58.7 64.2,65.8 63.27,66.73 IC11.1 | IC1.VOUT2 23.38,20.73 C19.+ C17.1 49.02,20.73 56.2,27.9 56.2,38.4 58.2,40.4 64.1,40.4 64.2,40.3
  Bottom 1.016: IC1.VOUT 23.32,20.73 IC1.VOUT2